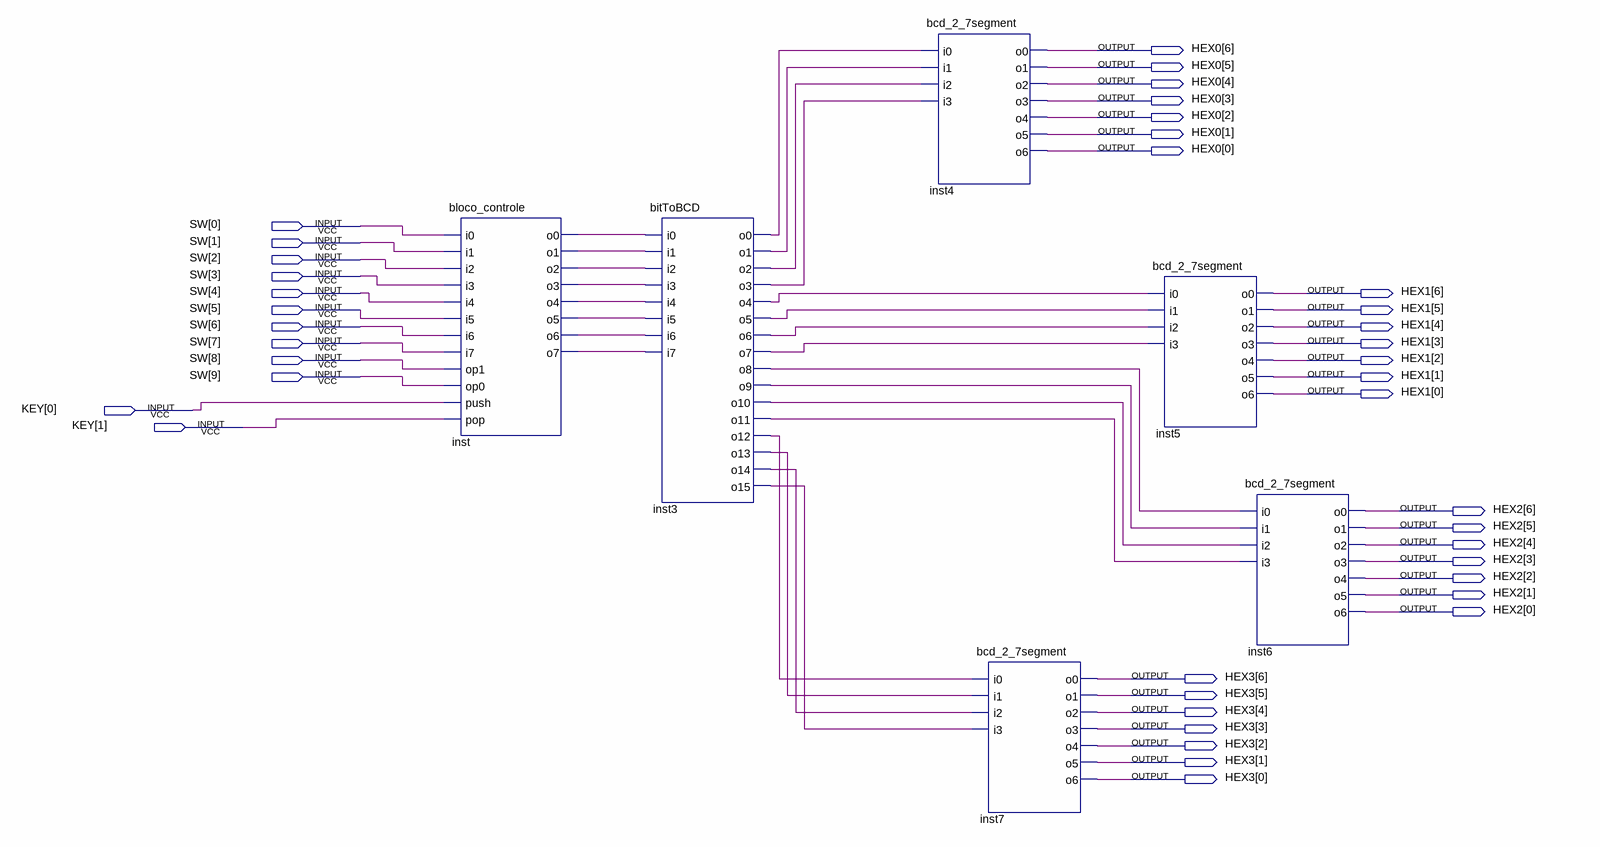
[diagram p0: schematic sheet]
// Quartus schematic calculadora.bdf as structural Verilog: 6 symbols, 40 pins
module calculadora (
  input  [9:0] SW,
  input  [1:0] KEY,
  output [6:0] HEX0,
  output [6:0] HEX1,
  output [6:0] HEX2,
  output [6:0] HEX3
);

  wire inst3_o0, inst3_o1, inst3_o2, inst3_o3, inst3_o4, inst3_o5, inst3_o6, inst3_o7, inst3_o8, inst3_o9,
       inst3_o10, inst3_o11, inst3_o12, inst3_o13, inst3_o14, inst3_o15, inst_o0, inst_o1, inst_o2, inst_o3,
       inst_o4, inst_o5, inst_o6, inst_o7;

  bloco_controle inst (
    .i0(SW[0]), .i1(SW[1]), .i2(SW[2]), .i3(SW[3]), .i4(SW[4]), .i5(SW[5]), .i6(SW[6]), .i7(SW[7]),
    .op1(SW[8]), .op0(SW[9]), .push(KEY[0]), .pop(KEY[1]), .o0(inst_o0), .o1(inst_o1), .o2(inst_o2),
    .o3(inst_o3), .o4(inst_o4), .o5(inst_o5), .o6(inst_o6), .o7(inst_o7));
  bitToBCD inst3 (
    .i0(inst_o0), .i1(inst_o1), .i2(inst_o2), .i3(inst_o3), .i4(inst_o4), .i5(inst_o5), .i6(inst_o6),
    .i7(inst_o7), .o0(inst3_o0), .o1(inst3_o1), .o2(inst3_o2), .o3(inst3_o3), .o4(inst3_o4), .o5(inst3_o5),
    .o6(inst3_o6), .o7(inst3_o7), .o8(inst3_o8), .o9(inst3_o9), .o10(inst3_o10), .o11(inst3_o11),
    .o12(inst3_o12), .o13(inst3_o13), .o14(inst3_o14), .o15(inst3_o15));
  bcd_2_7segment inst4 (
    .i0(inst3_o0), .i1(inst3_o1), .i2(inst3_o2), .i3(inst3_o3), .o0(HEX0[6]), .o1(HEX0[5]), .o2(HEX0[4]),
    .o3(HEX0[3]), .o4(HEX0[2]), .o5(HEX0[1]), .o6(HEX0[0]));
  bcd_2_7segment inst7 (
    .i0(inst3_o12), .i1(inst3_o13), .i2(inst3_o14), .i3(inst3_o15), .o0(HEX3[6]), .o1(HEX3[5]), .o2(HEX3[4]),
    .o3(HEX3[3]), .o4(HEX3[2]), .o5(HEX3[1]), .o6(HEX3[0]));
  bcd_2_7segment inst5 (
    .i0(inst3_o4), .i1(inst3_o5), .i2(inst3_o6), .i3(inst3_o7), .o0(HEX1[6]), .o1(HEX1[5]), .o2(HEX1[4]),
    .o3(HEX1[3]), .o4(HEX1[2]), .o5(HEX1[1]), .o6(HEX1[0]));
  bcd_2_7segment inst6 (
    .i0(inst3_o8), .i1(inst3_o9), .i2(inst3_o10), .i3(inst3_o11), .o0(HEX2[6]), .o1(HEX2[5]), .o2(HEX2[4]),
    .o3(HEX2[3]), .o4(HEX2[2]), .o5(HEX2[1]), .o6(HEX2[0]));
endmodule
